# Altium project PCB_Project.PrjPcb
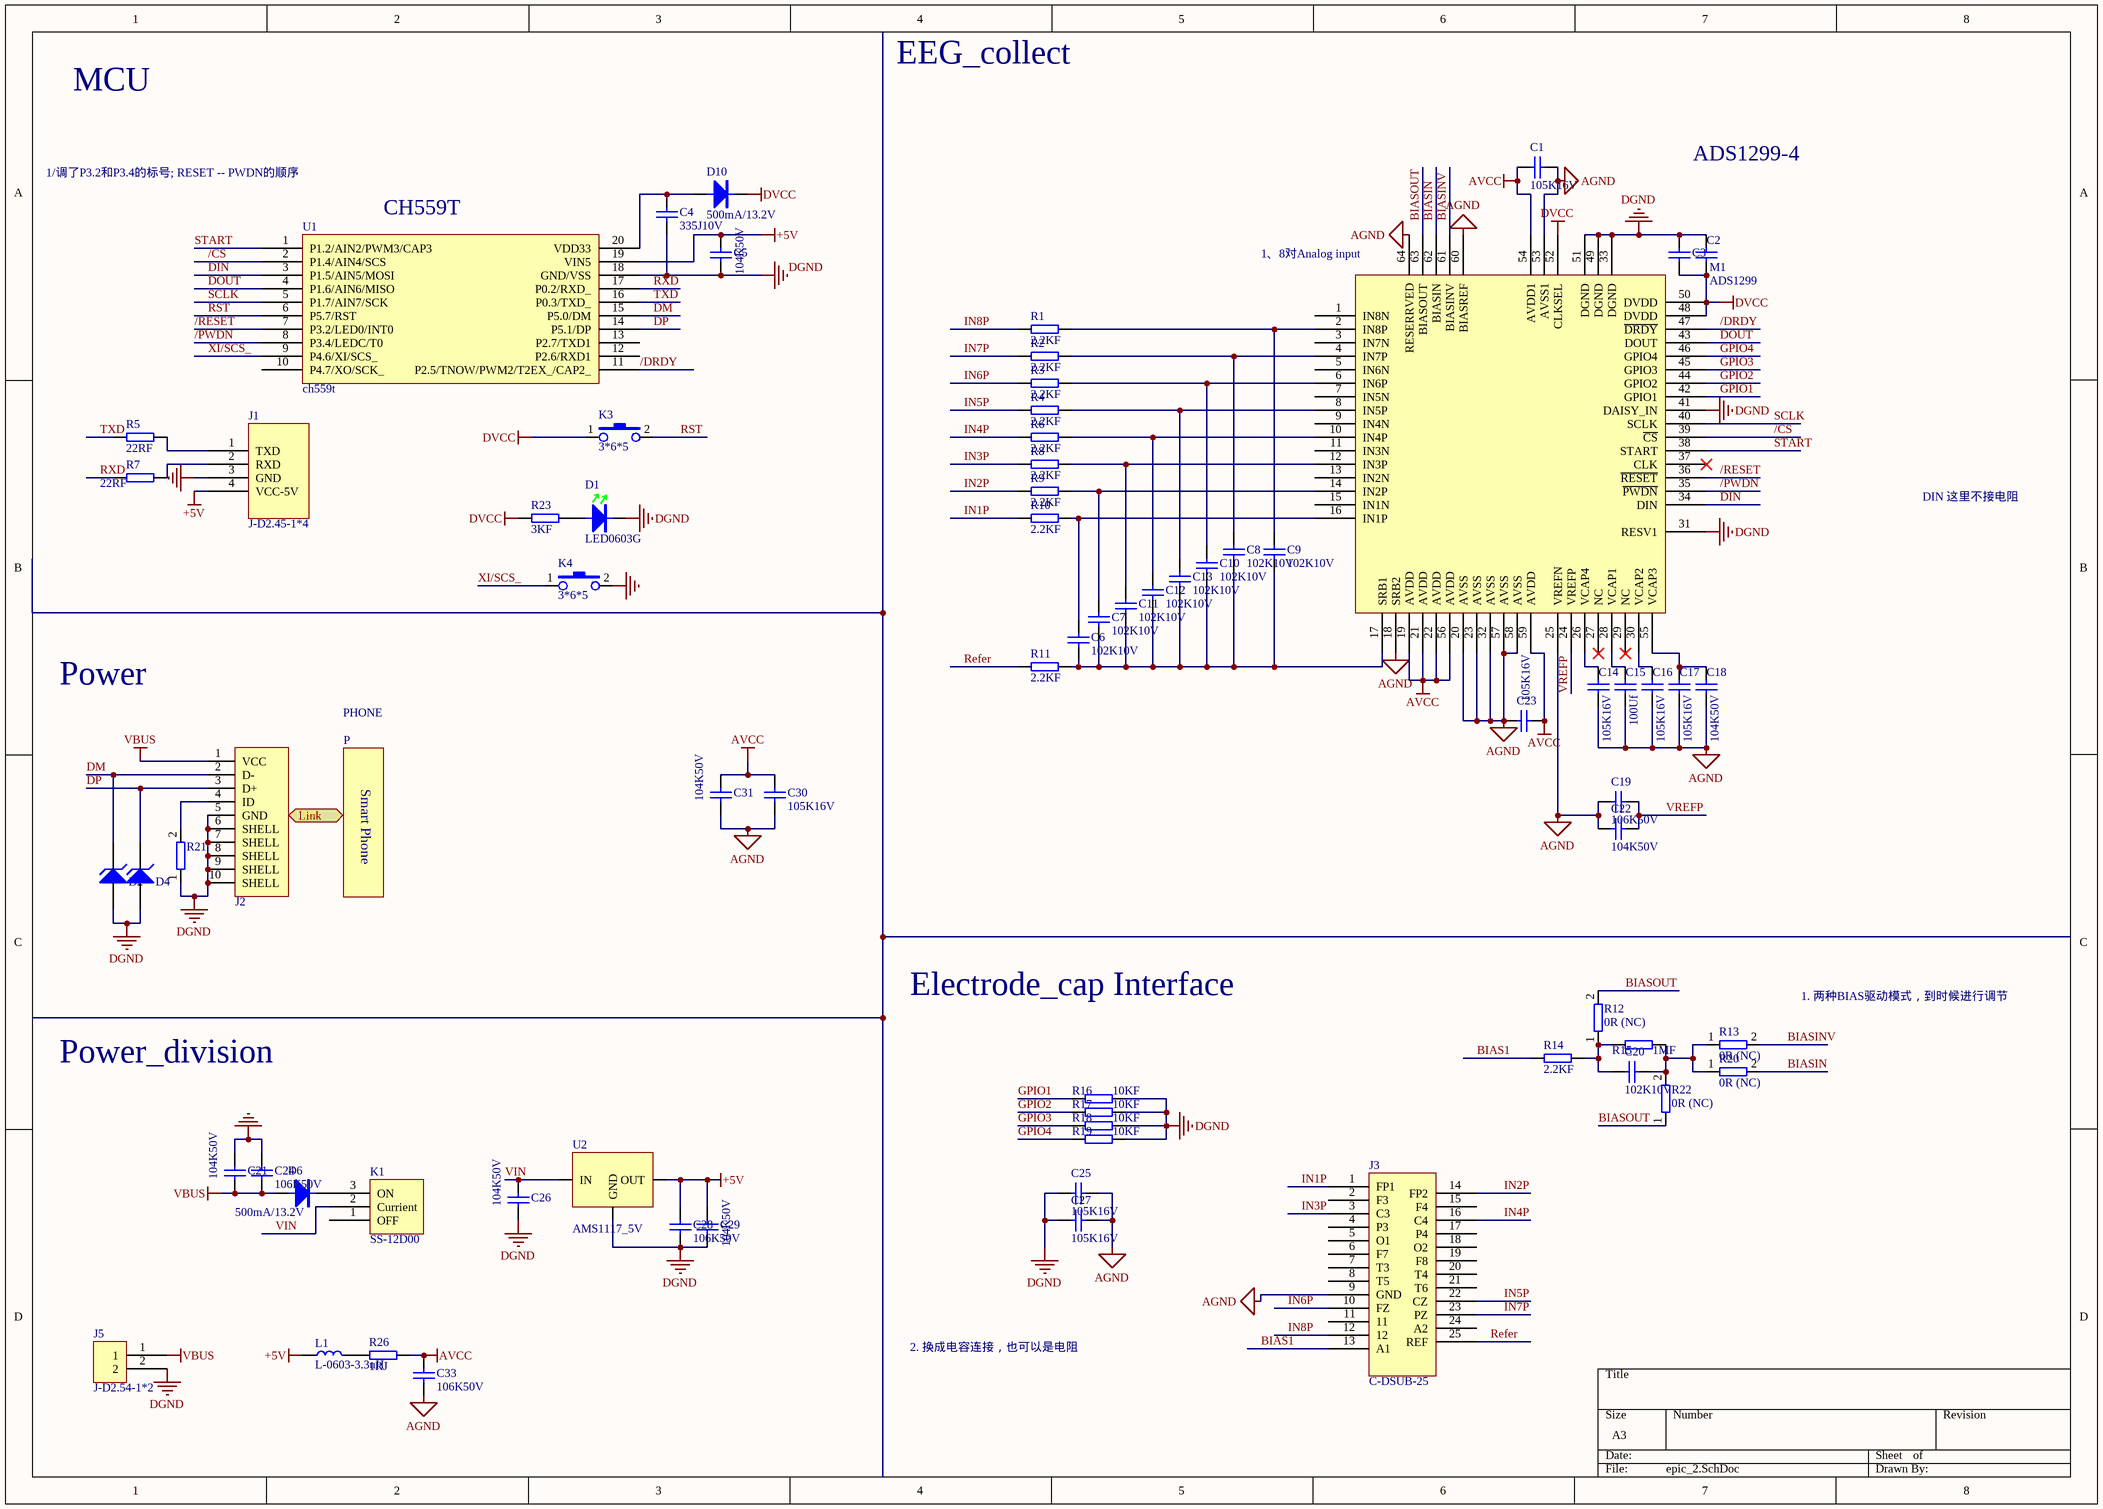
[diagram p0: epic_2.SchDoc]
1 sheet, 73 parts. Net scope: flat (ports and power ports of the same name join across sheets).
Board files: epic2.PcbDoc, jointed board.PcbDoc

## Sheet epic_2.SchDoc
size A3

### Parts
C1  105K16V  [C0603]
C2  104K50V  [C0603]  (value not drawn)
C3  105K16V  [C0603]  (value not drawn)
C4  335J10V  [C0603]
C5  104K50V  [C0603]
C6  102K10V  [C0603]
C7  102K10V  [C0603]
C8  102K10V  [C0603]
C9  102K10V  [C0603]
C10  102K10V  [C0603]
C11  102K10V  [C0603]
C12  102K10V  [C0603]
C13  102K10V  [C0603]
C14  105K16V  [C0603]
C15  100Uf  [C1210]
C16  105K16V  [C0603]
C17  105K16V  [C0603]
C18  104K50V  [C0603]
C19  106K50V  [C0603]
C20  102K10V  [C0603]
C21  104K50V  [C0603]
C22  104K50V  [C0603]
C23  105K16V  [C0603]
C24  106K50V  [C0603]
C25  105K16V  [C0603]
C26  104K50V  [C0603]
C27  105K16V  [C0603]
C28  106K50V  [C0603]
C29  104K50V  [C0603]
C30  105K16V  [C0603]
C31  104K50V  [C0603]
C33  106K50V  [C0603]
D1  LED0603G  [D-LED0603G]
D2  ESDA_TR1/0603  [HS_0603D]  (value not drawn)
D4  ESDA_TR1/0603  [HS_0603D]  (value not drawn)
D6  500mA/13.2V  [D1206]
D10  500mA/13.2V  [D1206]
J1  J-D2.45-1*4  [D2.54-1*4P]
J2  USB-MINI-SOCKET  [MICRO-USB - 5.9]  (value not drawn)
J3  C-DSUB-25  [C-DSUB-25]
J5  J-D2.54-1*2  [D2.54-1*2P]
K1  SS-12D00  [SS-12D00]
K3  3*6*5  [S-K3*6]
K4  3*6*5  [S-K3*6]
L1  L-0603-3.3uH  [L0603]
M1  ADS1299  [ADS1299-TSQFP50P1200X1200X105-64N]
P  PHONE
R1  2.2KF  [R0603]
R2  2.2KF  [R0603]
R3  2.2KF  [R0603]
R4  2.2KF  [R0603]
R5  22RF  [R0603]
R6  2.2KF  [R0603]
R7  22RF  [R0603]
R8  2.2KF  [R0603]
R9  2.2KF  [R0603]
R10  2.2KF  [R0603]
R11  2.2KF  [R0603]
R12  0R (NC)  [R0603]
R13  0R (NC)  [R0603]
R14  2.2KF  [R0603]
R15  1MF  [R0603]
R16  10KF  [R0603]
R17  10KF  [R0603]
R18  10KF  [R0603]
R19  10KF  [R0603]
R20  0R (NC)  [R0603]
R21  0R  [R0603]  (value not drawn)
R22  0R (NC)  [R0603]
R23  3KF  [R0603]
R26  1RJ  [R0603]
U1  ch559t  [SSOP-20]
U2  AMS1117_5V  [SOT-223]

### Ports
Link

### Nets
+5V: C5.1 C28.2 C29.1 J1.4(VCC-5V) L1.1 U1.19(VIN5) U2.2(OUT)
AGND: C1.1 C14.2 C15.2 C16.2 C17.2 C18.1 C19.2 C22.2 C23.2 C25.2 C27.2 C30.2 C31.2 C33.1 J3.9(GND) M1.18(SRB2) M1.20(AVSS) M1.23(AVSS) M1.25(VREFN) M1.32(AVSS) M1.53(AVSS1) M1.57(AVSS) M1.58(AVSS) M1.60(BIASREF) M1.64(RESERRVED)
AVCC: C1.2 C23.1 C30.1 C31.1 C33.2 M1.19(AVDD) M1.21(AVDD) M1.22(AVDD) M1.54(AVDD1) M1.56(AVDD) M1.59(AVDD) R26.1
DGND: C2.2 C3.2 C4.2 C5.2 C21.1 C24.2 C25.1 C26.2 C27.1 C28.1 C29.2 D1.2 D2.1(A) D4.1(A) J1.3(GND) J2.5(GND) J2.6(SHELL) J2.7(SHELL) J2.8(SHELL) J2.9(SHELL) J2.10(SHELL) J5.2 K4.2 M1.31(RESV1) M1.33(DGND) M1.41(DAISY_IN) M1.49(DGND) M1.51(DGND) R16.2 R17.2 R18.2 R19.2 R21.1 U1.18(GND/VSS) U2.1(GND)
DVCC: C2.1 C3.1 D10.2 K3.1 M1.48(DVDD) M1.50(DVDD) M1.52(CLKSEL) R23.1
VBUS: C21.2 C24.1 D6.1 J2.1(VCC) J5.1
/CS: M1.39(~{CS}) U1.2(P1.4/AIN4/SCS)
/DRDY: M1.47(~{DRDY}) U1.11(P2.5/TNOW/PWM2/T2EX_/CAP2_)
/PWDN: M1.35(~{PWDN}) U1.8(P3.4/LEDC/T0)
/RESET: M1.36(~{RESET}) U1.7(P3.2/LED0/INT0)
BIAS1: J3.13(A1) R14.1
BIASIN: M1.62(BIASIN) R20.2
BIASINV: M1.61(BIASINV) R13.2
BIASOUT: M1.63(BIASOUT) R12.2 R22.1
DIN: M1.34(DIN) U1.3(P1.5/AIN5/MOSI)
DM: D2.2(K) J2.2(D-) U1.15(P5.0/DM)
DOUT: M1.43(DOUT) U1.4(P1.6/AIN6/MISO)
DP: D4.2(K) J2.3(D+) U1.14(P5.1/DP)
GPIO1: M1.42(GPIO1) R16.1
GPIO2: M1.44(GPIO2) R17.1
GPIO3: M1.45(GPIO3) R18.1
GPIO4: M1.46(GPIO4) R19.1
IN1P: J3.1(FP1) R10.1
IN2P: J3.14(FP2) R9.1
IN3P: J3.3(C3) R8.1
IN4P: J3.16(C4) R6.1
IN5P: J3.22(CZ) R4.1
IN6P: J3.10(FZ) R3.1
IN7P: J3.23(PZ) R2.1
IN8P: J3.12 R1.1
Refer: J3.25(REF) R11.1
RST: K3.2 U1.6(P5.7/RST)
RXD: R7.2 U1.17(P0.2/RXD_)
SCLK: M1.40(SCLK) U1.5(P1.7/AIN7/SCK)
START: M1.38(START) U1.1(P1.2/AIN2/PWM3/CAP3)
TXD: R5.2 U1.16(P0.3/TXD_)
VIN: C26.1 K1.2(Currient) U2.3(IN)
VREFP: C19.1 C22.1 M1.24(VREFP)
XI/SCS_: K4.1 U1.9(P4.6/XI/SCS_)
NetC4_1: C4.1 D10.1 U1.20(VDD33)
NetC6_1: C6.1 M1.16(IN1P) R10.2
NetC6_2: C6.2 C7.2 C8.2 C9.2 C10.2 C11.2 C12.2 C13.2 M1.17(SRB1) R11.2
NetC7_1: C7.1 M1.14(IN2P) R9.2
NetC8_1: C8.1 M1.4(IN7P) R2.2
NetC9_1: C9.1 M1.2(IN8P) R1.2
NetC10_1: C10.1 M1.6(IN6P) R3.2
NetC11_1: C11.1 M1.12(IN3P) R8.2
NetC12_1: C12.1 M1.10(IN4P) R6.2
NetC13_1: C13.1 M1.8(IN5P) R4.2
NetC14_1: C14.1 M1.26(VCAP4)
NetC15_1: C15.1 M1.28(VCAP1)
NetC16_1: C16.1 M1.30(VCAP2)
NetC17_1: C17.1 C18.2 M1.55(VCAP3)
NetC20_1: C20.1 R13.1 R15.2 R20.1 R22.2
NetC20_2: C20.2 R12.1 R14.2 R15.1
NetD1_1: D1.1 R23.2
NetD6_2: D6.2 K1.3(ON)
NetJ1_1: J1.1(TXD) R5.1
NetJ1_2: J1.2(RXD) R7.1
NetJ2_4: J2.4(ID) R21.2
NetL1_2: L1.2 R26.2

Not connected (* = marked no-connect by the designer): J3 2(F3) 4(P3) 5(O1) 6(F7) 7(T3) 8(T5) 11 15(F4) 17(P4) 18(O2) 19(F8) 20(T4) 21(T6) 24(A2); K1 1(OFF); M1 1(IN8N) 3(IN7N) 5(IN6N) 7(IN5N) 9(IN4N) 11(IN3N) 13(IN2N) 15(IN1N) 27(NC)* 29(NC)* 37(CLK)*; U1 10(P4.7/XO/SCK_) 12(P2.6/RXD1) 13(P2.7/TXD1)

### Notes on the sheet
- MCU
- EEG_collect
- 1/调了P3.2和P3.4的标号; RESET -- PWDN的顺序
- ADS1299-4
- (near U1) CH559T
- (near M1) 1、8对Analog input
- DIN 这里不接电阻
- Power
- Electrode_cap Interface
- 1. 两种BIAS驱动模式，到时候进行调节
- Power_division
- 2. 换成电容连接，也可以是电阻
- Labels drawn without touching a wire or pin: DGND
- (in symbol PHONE) Smart Phone

### Library data of the parts
C1 C3 C14 C16 C17 C23 C25 C27 C30 = C0603X7R-105K16V: 贴片电容-陶瓷; 规格型号: 1uF±10%_16V_X7R_C0603; 生产商: 风华 三星; 供应商: *; 备注: *
C2 C5 C18 C21 C22 C26 C29 C31 = C0603X7R-104K50V: 贴片电容-陶瓷; 规格型号: 100nF±10%_50V_X7R_C0603; 生产商: 风华 三星; 供应商: *; 备注: *
C4 = C0603X7R-335J10V: 贴片电容-陶瓷
C6-C13 C20 = C0603X7R-102K10V: 贴片电容-陶瓷
C15 = C1210钽电容 --100UF--B3528: C1210-100UF
C19 C24 C28 C33 = C0603X7R-106K50V: 贴片电容-陶瓷; 规格型号: 10uF±10%_50V_X7R_C0603; 生产商: 风华 三星; 供应商: *; 备注: *
D1 = DLED-0603-G: 贴片二极管-LED; 规格型号: 0603-GREEN; 货品编码: 无样品无编码; 生产商: *; 供应商: *; 备注: *
D2 D4 = D Zener: Zener Diode; Published: *; LatestRevisionDate: *; LatestRevisionNote: *; PackageReference: *; Publisher: *
D6 D10 = 1206MSD: 500mA/13.2V 自恢复保险丝
J1 = J-D2.54-1*4单排排母
J2 = J-USB-MINI-SOCKET: USB-A卧式插座; 供应商: *; 备注: *
J3 = C-DSUB-25: C-DSUB-0064
J5 = J-D2.54-1*2单排
K1 = SS-12D00(1P2T) 立式 柄高5MM
K3 K4 = 3*6*5: 贴片-卧式轻触开关
L1 = L-0603-3.3uH: 贴片电感-屏蔽; 生产商: *; 供应商: *; 备注: *
M1 = ADS1299: ADS1299-S-PQFP-64; ADS1299: S-PQFP-64
R1-R4 R6 R8-R11 R14 = R0603-2.2KF: 贴片电阻-通用; 生产商: 厚声 国巨; 规格型号: 2.2K±1%_1/10W_±200ppm_R0603; 货品编码: 无样品无编码; 备注: *; 供应商: *
R5 R7 = R0603-22RF: 贴片电阻-通用; 生产商: 厚声 国巨; 规格型号: 22R±5%_1/10W_±200ppm_R0603; 货品编码: 无样品无编码; 备注: *; 供应商: *
R12 R13 R20-R22 = R0603-0R: 贴片电阻-通用; 生产商: 厚声 国巨; 规格型号: 0R_1/10W_±200ppm_R0603; 货品编码: 无样品无编码; 备注: *; 供应商: *
R15 = R0603-1MF: 贴片电阻-通用; value: 1MF 0603贴片电阻-通用; 厂商: 10K±1%_1/10W_±200ppm_R0603 国巨
R16-R19 = R0603-10KF: 贴片电阻-通用; 生产商: 厚声 国巨; 规格型号: 10K±1%_1/10W_±200ppm_R0603; 备注: *; 供应商: *
R23 = R0603-3KF: 贴片电阻-通用; 生产商: 厚声 国巨; 规格型号: 3K±1%_1/10W_±200ppm_R0603; 货品编码: 无样品无编码; 备注: *; 供应商: *
R26 = R0603-1RJ: 贴片电阻-通用; 生产商: 厚声 国巨; 规格型号: 1R±5%_1/10W_±200ppm_R0603; 货品编码: 无样品无编码; 备注: *; 供应商: *
U1 = CH559T: CH559T-20pin
U2 = AMS1117-5V